# Altium schematic sheet MAZ000160 - Diagrama eléctrico.SchDoc: MAZ000160 - Diagrama eléctrico
size A; ApprovedBy: Christian Ledwidth; CheckedBy: Nahuel Martinez; Author: Santiago Marti; CompanyName: Body Health; DrawnBy: Santiago Marti; Revision: A; SheetNumber: 1; SheetTotal: 2
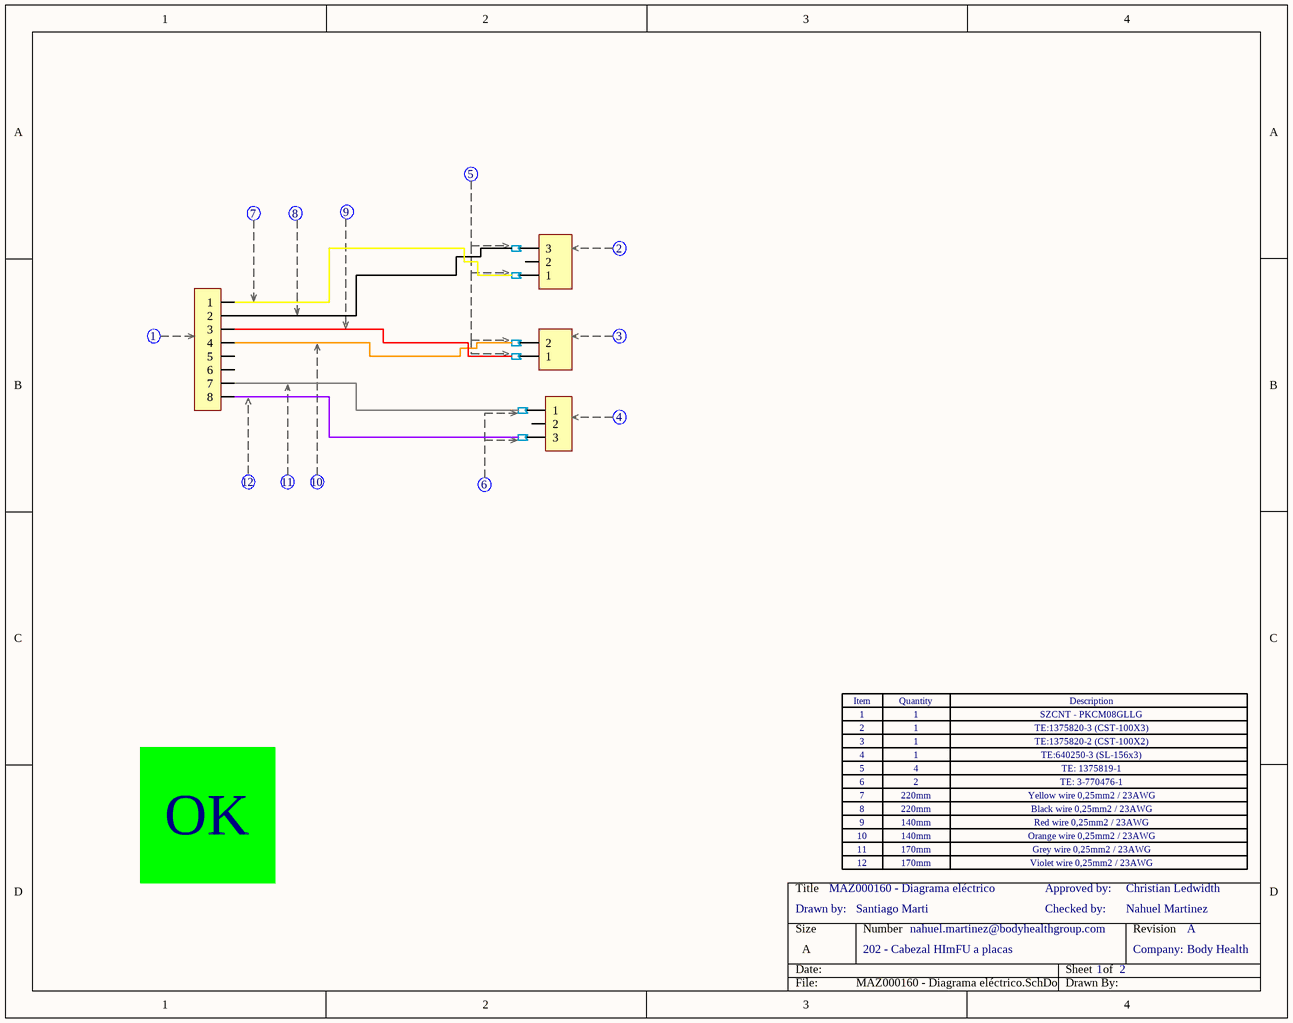
[diagram p0: MAZ000160 - Diagrama eléctrico.SchDoc]

## Parts
Con1  CST-100-3  (value not drawn)  (parts C,D of 4)
Con2  CST-100-2  (value not drawn)  (parts C,D of 4)
Con3  SL156-3  (value not drawn)  (parts C,D of 4)
Conn1  SZCNT_08_Hembra  (value not drawn)  (parts B,C of 3)
Soc1  sock_CST_1375819-1  (value not drawn)  (parts A,B of 2)
Soc2  sock_SL156_770476-1  (value not drawn)  (parts A,B of 2)
Soc3  sock_SL156_770476-1  (value not drawn)  (parts A,B of 2)
Soc4  sock_SL156_770476-1  (value not drawn)  (part A of 2)
Soc5  sock_CST_1375819-1  (value not drawn)  (part B of 2)
Soc6  sock_CST_1375819-1  (value not drawn)  (part B of 2)
Soc7  sock_CST_1375819-1  (value not drawn)  (part B of 2)
Soc8  sock_SL156_770476-1  (value not drawn)  (part A of 2)
Soc9  sock_SL156_770476-1  (value not drawn)  (part A of 2)
Soc10  sock_SL156_770476-1  (value not drawn)  (part A of 2)
Soc11  sock_SL156_770476-1  (value not drawn)  (part A of 2)
Zoc1  Zócalo_Header  (value not drawn)
Zoc2  Zócalo_Item  (value not drawn)
Zoc3  Zócalo_Item  (value not drawn)
Zoc4  Zócalo_Item  (value not drawn)
Zoc5  Zócalo_Item  (value not drawn)
Zoc6  Zócalo_Item  (value not drawn)
Zoc7  Zócalo_Item  (value not drawn)
Zoc8  Zócalo_Item  (value not drawn)
Zoc9  Zócalo_Item  (value not drawn)
Zoc10  Zócalo_Item  (value not drawn)
Zoc11  Zócalo_Item  (value not drawn)
Zoc12  Zócalo_Item  (value not drawn)
Zoc13  Zócalo_Item  (value not drawn)

## Nets
NetCon1_1: Con1.1 Soc5.0
NetCon1_3: Con1.3 Soc1.0
NetCon2_1: Con2.1 Soc7.0
NetCon2_2: Con2.2 Soc6.0
NetCon3_1: Con3.1 Soc2.0
NetCon3_3: Con3.3 Soc3.0
NetConn1_1: Conn1.1 Soc5.1
NetConn1_2: Conn1.2 Soc1.1
NetConn1_3: Conn1.3 Soc7.1
NetConn1_4: Conn1.4 Soc6.1
NetConn1_7: Conn1.7 Soc2.1
NetConn1_8: Conn1.8 Soc3.1

Not connected (* = marked no-connect by the designer): Con1 2; Con3 2; Conn1 5 6

## Notes on the sheet
- 1
- 2
- 3
- 4
- 5
- 6
- SZCNT - PKCM08GLLG
- TE:1375820-3 (CST-100X3)
- TE:1375820-2 (CST-100X2)
- TE:640250-3 (SL-156x3)
- TE: 1375819-1
- TE: 3-770476-1
- OK
- 7
- 8
- 9
- 10
- 220mm
- 140mm
- Yellow wire 0,25mm2 / 23AWG
- Black wire 0,25mm2 / 23AWG
- Red wire 0,25mm2 / 23AWG
- Orange wire 0,25mm2 / 23AWG
- Drawn by:
- 11
- 12
- 170mm
- Checked by:
- Approved by:
- Grey wire 0,25mm2 / 23AWG
- Violet wire 0,25mm2 / 23AWG
- 202 - Cabezal HImFU a placas
- nahuel.martinez@bodyhealthgroup.com
- Company:
- (in symbol Zócalo_Header) Item; Quantity; Description

## Library data of the parts
Con1 = CST-100-3: CONN RCPT HSNG 3POS CST-100 II; Cod.Fabricante: 1375820-3; Fabricante: TE Connectivity AMP Connectors; CallOut: 2; Cod.DigiKey: A99614-ND; ComponentLink1Description: Manufacturer Link; ComponentLink1URL: https://www.te.com/commerce/DocumentDelivery/DDEController?Action=srchrtrv&DocNm=1375820&DocType=Customer+Drawing&DocLang=English; DIGIKEYx50: 0.12620; DIGIKEYx100: 0.11720
Con2 = CST-100-2: CONN RCPT HSNG 2POS CST-100 II; Cod.Fabricante: 1375820-2; Fabricante: TE Connectivity AMP Connectors; CallOut: 3; Cod.DigiKey: A99613-ND; ComponentLink1Description: Manufacturer Link; ComponentLink1URL: https://www.te.com/commerce/DocumentDelivery/DDEController?Action=srchrtrv&DocNm=1375820&DocType=Customer+Drawing&DocLang=English; DIGIKEYx50: 0.08380; DIGIKEYx100: NO
Con3 = SL156-3: CONN RECEPT 3 POS W/RAMP SL-156; Cod.Fabricante: 640250-3; Fabricante: TE Connectivity AMP Connectors; CallOut: 4; Cod.DigiKey: A19951-ND; ComponentLink1Description: Manufacturer Link; ComponentLink1URL: https://www.te.com/commerce/DocumentDelivery/DDEController?Action=srchrtrv&DocNm=640250&DocType=Customer+Drawing&DocLang=English; DIGIKEYx50: 0.14460; DIGIKEYx100: 0.13430
Conn1 = SZCNT_08_Hembra: Conector SZCNT 8 vías hembra para gabinete; CallOut: 1; Cod.DigiKey: Se compra a SZCNT; Cod.Fabricante: *; ComponentLink1Description: Manufacturer Link; ComponentLink1URL: *; DIGIKEYx100: *; Fabricante: SZCNT; DIGIKEYx50: *
Soc1 = sock_CST_1375819-1: CONN SOCKET 22-26AWG CRIMP TIN; Fabricante: TE Connectivity AMP Connectors; CallOut: 5; Cod.DigiKey: A100453CT-ND; Cod.Fabricante: 1375819-1; ComponentLink1Description: Manufacturer Link; ComponentLink1URL: https://www.te.com/commerce/DocumentDelivery/DDEController?Action=srchrtrv&DocNm=1375819&DocType=Customer+Drawing&DocLang=English; DIGIKEYx100: 0.04210; DIGIKEYx50: 0.03960
Soc2 = sock_SL156_770476-1: CONN SOCKET 18-24AWG CRIMP TIN; Fabricante: TE Connectivity AMP Connectors; CallOut: 9; Cod.DigiKey: A19993CT-ND; Cod.Fabricante: 770476-1; ComponentLink1Description: Manufacturer Link; ComponentLink1URL: https://www.te.com/commerce/DocumentDelivery/DDEController?Action=srchrtrv&DocNm=770476&DocType=Customer+Drawing&DocLang=English; DIGIKEYx100: 0.08690; DIGIKEYx50: 0.08180
Soc3 = sock_SL156_770476-1: CONN SOCKET 18-24AWG CRIMP TIN; Fabricante: TE Connectivity AMP Connectors; CallOut: 7; Cod.DigiKey: A19993CT-ND; Cod.Fabricante: 770476-1; ComponentLink1Description: Manufacturer Link; ComponentLink1URL: https://www.te.com/commerce/DocumentDelivery/DDEController?Action=srchrtrv&DocNm=770476&DocType=Customer+Drawing&DocLang=English; DIGIKEYx100: 0.08690; DIGIKEYx50: 0.08180
Soc4 = sock_SL156_770476-1: CONN SOCKET 18-24AWG CRIMP TIN; Fabricante: TE Connectivity AMP Connectors; CallOut: 8; Cod.DigiKey: A19993CT-ND; Cod.Fabricante: 770476-1; ComponentLink1Description: Manufacturer Link; ComponentLink1URL: https://www.te.com/commerce/DocumentDelivery/DDEController?Action=srchrtrv&DocNm=770476&DocType=Customer+Drawing&DocLang=English; DIGIKEYx100: 0.08690; DIGIKEYx50: 0.08180
Soc5-Soc7 = sock_CST_1375819-1: CONN SOCKET 22-26AWG CRIMP TIN; Fabricante: TE Connectivity AMP Connectors; Cod.DigiKey: A100453CT-ND; Cod.Fabricante: 1375819-1; ComponentLink1Description: Manufacturer Link; ComponentLink1URL: https://www.te.com/commerce/DocumentDelivery/DDEController?Action=srchrtrv&DocNm=1375819&DocType=Customer+Drawing&DocLang=English; DIGIKEYx100: 0.04210; CallOut: *; DIGIKEYx50: 0.03960
Soc8 = sock_SL156_770476-1: CONN SOCKET 18-24AWG CRIMP TIN; Fabricante: TE Connectivity AMP Connectors; CallOut: 12; Cod.DigiKey: A19993CT-ND; Cod.Fabricante: 770476-1; ComponentLink1Description: Manufacturer Link; ComponentLink1URL: https://www.te.com/commerce/DocumentDelivery/DDEController?Action=srchrtrv&DocNm=770476&DocType=Customer+Drawing&DocLang=English; DIGIKEYx100: 0.08690; DIGIKEYx50: 0.08180
Soc9 = sock_SL156_770476-1: CONN SOCKET 18-24AWG CRIMP TIN; Fabricante: TE Connectivity AMP Connectors; CallOut: 11; Cod.DigiKey: A19993CT-ND; Cod.Fabricante: 770476-1; ComponentLink1Description: Manufacturer Link; ComponentLink1URL: https://www.te.com/commerce/DocumentDelivery/DDEController?Action=srchrtrv&DocNm=770476&DocType=Customer+Drawing&DocLang=English; DIGIKEYx100: 0.08690; DIGIKEYx50: 0.08180
Soc10 = sock_SL156_770476-1: CONN SOCKET 18-24AWG CRIMP TIN; Fabricante: TE Connectivity AMP Connectors; CallOut: 10; Cod.DigiKey: A19993CT-ND; Cod.Fabricante: 770476-1; ComponentLink1Description: Manufacturer Link; ComponentLink1URL: https://www.te.com/commerce/DocumentDelivery/DDEController?Action=srchrtrv&DocNm=770476&DocType=Customer+Drawing&DocLang=English; DIGIKEYx100: 0.08690; DIGIKEYx50: 0.08180
Soc11 = sock_SL156_770476-1: CONN SOCKET 18-24AWG CRIMP TIN; Fabricante: TE Connectivity AMP Connectors; CallOut: 6; Cod.DigiKey: A19993CT-ND; Cod.Fabricante: 770476-1; ComponentLink1Description: Manufacturer Link; ComponentLink1URL: https://www.te.com/commerce/DocumentDelivery/DDEController?Action=srchrtrv&DocNm=770476&DocType=Customer+Drawing&DocLang=English; DIGIKEYx100: 0.08690; DIGIKEYx50: 0.08180
Zoc1 = Zócalo_Header: Header para el zócalo de referencias
Zoc2-Zoc13 = Zócalo_Item: Ítem para el zócalo de referencias; Desginator: *; Quantity: *; ItemDescription: *